# Altium project FR5969v1.0.PrjPcb
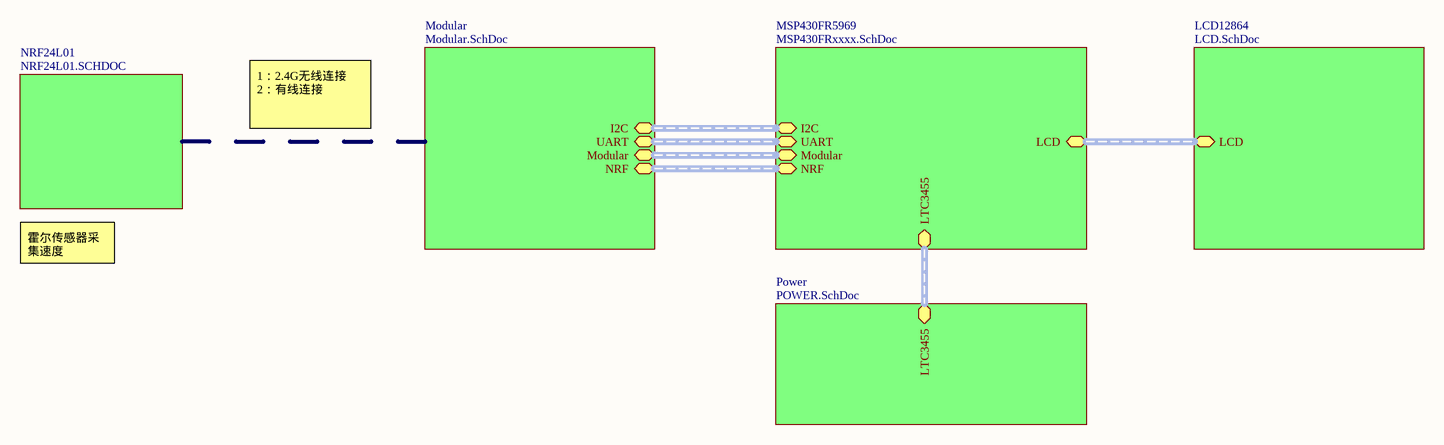
[diagram p0: FR5969v1.0.SchDoc]
5 sheets, 80 parts. Net scope: hierarchical (ports join the sheet entries above them; power ports are global).
Board file: FR5969v1.0.PcbDoc
Sheets:
  FR5969v1.0.SchDoc
    MSP430FR5969 = MSP430FRxxxx.SchDoc
    Modular = Modular.SchDoc
    LCD12864 = LCD.SchDoc
    Power = POWER.SchDoc

## Sheet FR5969v1.0.SchDoc
size A4

### Sub-sheets
LCD12864 = LCD.SchDoc: LCD (harness LCD)
Modular = Modular.SchDoc: I2C (harness IC2), UART (harness UART), Modular (harness Modular), NRF (harness NRF)
MSP430FR5969 = MSP430FRxxxx.SchDoc: LCD (harness LCD), LTC3455 (harness LTC3455), I2C (harness IC2), UART (harness UART), Modular (harness Modular), NRF (harness NRF)
NRF24L01 = NRF24L01.SCHDOC (file not in this document): no entries
Power = POWER.SchDoc: LTC3455 (harness LTC3455)

### Buses and harness runs
harness sheet LCD12864/LCD = sheet MSP430FR5969/LCD
harness sheet Modular/I2C = sheet MSP430FR5969/I2C
harness sheet Modular/Modular = sheet MSP430FR5969/Modular
harness sheet Modular/NRF = sheet MSP430FR5969/NRF
harness sheet Modular/UART = sheet MSP430FR5969/UART
harness sheet MSP430FR5969/LTC3455 = sheet Power/LTC3455

### Notes on the sheet
- 1：2.4G无线连接
  2：有线连接
- 霍尔传感器采集速度

## Sheet MSP430FRxxxx.SchDoc
size A4; Organization: Altium Limited; Address1: L3, 12a Rodborough Rd; Address2: Frenchs Forest; Address3: NSW; Address4: Australia 2086
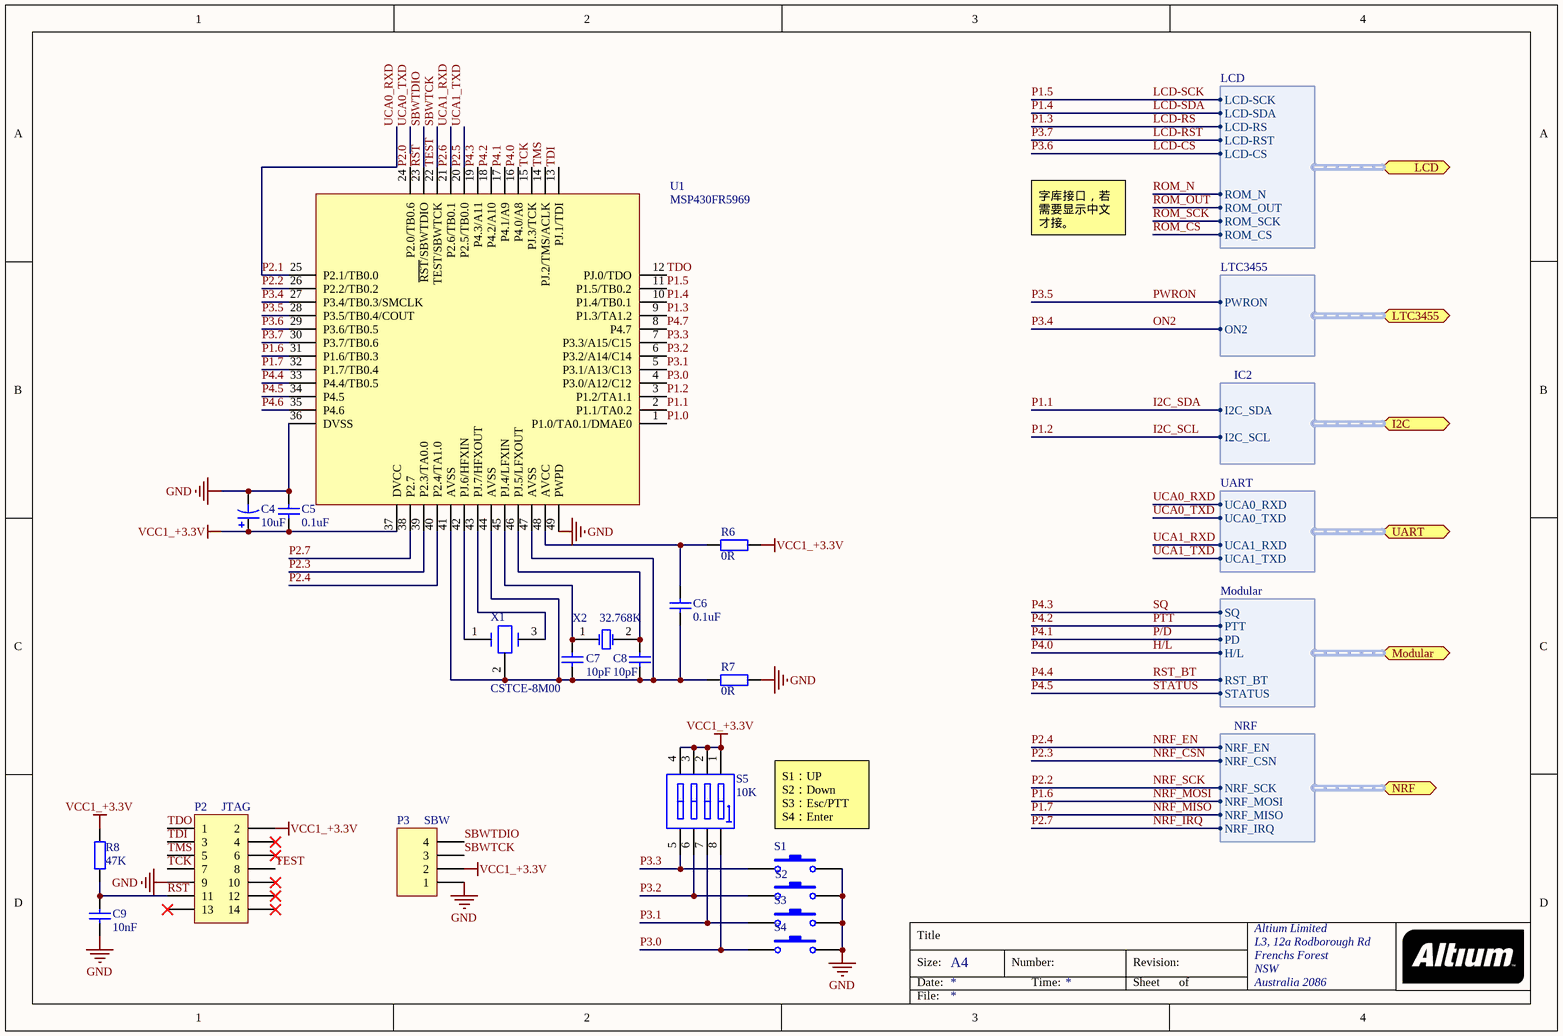
[diagram p1: MSP430FRxxxx.SchDoc]

### Parts
C4  value 10uF  [SMA-C]  (hidden comment: Cap Pol1)
C5  value 0.1uF  [C0805]  (hidden comment: Cap)
C6  value 0.1uF  [C0805]  (hidden comment: Cap)
C7  value 10pF  [C0805]  (hidden comment: Cap)
C8  value 10pF  [C0805]  (hidden comment: Cap)
C9  value 10nF  [C0805]  (hidden comment: Cap)
P2  JTAG  [JTAG]
P3  SBW  [HDR1X4]
R6  value 0R  [R0805]  (hidden comment: Res2)
R7  value 0R  [R0805]  (hidden comment: Res2)
R8  value 47K  [R0805]  (hidden comment: Res2)
S1  SW-PB  [SW-SMD1]  (value not drawn)
S2  SW-PB  [SW-SMD1]  (value not drawn)
S3  SW-PB  [SW-SMD1]  (value not drawn)
S4  SW-PB  [SW-SMD1]  (value not drawn)
S5  10K  [R0805-4P]
U1  MSP430FR5969  [QFN-48]
X1  CSTCE-8M00  [CSTCE-8M00]
X2  32.768K  [32768]

### Ports
I2C (harness IC2), LCD (harness LCD), LTC3455 (harness LTC3455), Modular (harness Modular), NRF (harness NRF), UART (harness UART)

### Harnesses
LTC3455: PWRON, ON2
IC2: I2C_SDA, I2C_SCL
UART: UCA0_RXD, UCA0_TXD, UCA1_RXD, UCA1_TXD
Modular: SQ, PTT, PD, H/L, RST_BT, STATUS
NRF: NRF_EN, NRF_CSN, NRF_SCK, NRF_MOSI, NRF_MISO, NRF_IRQ
LCD: LCD-SCK, LCD-SDA, LCD-RS, LCD-RST, LCD-CS, ROM_N, ROM_OUT, ROM_SCK, ROM_CS

### Nets
GND: C4.2 C5.1 C9.2 P2.9 P3.1 R7.2 S1.2 S2.2 S3.2 S4.2 U1.36(DVSS) U1.49(PWPD)
VCC1_+3.3V: C4.1 C5.2 P2.2 P3.2 R6.2 R8.2 S5.1(A1) S5.2(A2) S5.3(A3) S5.4(A4) U1.37(DVCC)
H/L: U1.16(P4.0/A8) ; port Modular.H/L  [also labelled P4.0]
I2C_SCL: U1.3(P1.2/TA1.1) ; port I2C.I2C_SCL  [also labelled P1.2]
I2C_SDA: U1.2(P1.1/TA0.2) ; port I2C.I2C_SDA  [also labelled P1.1]
LCD-CS: U1.29(P3.6/TB0.5) ; port LCD.LCD-CS  [also labelled P3.6]
LCD-RS: U1.9(P1.3/TA1.2) ; port LCD.LCD-RS  [also labelled P1.3]
LCD-RST: U1.30(P3.7/TB0.6) ; port LCD.LCD-RST  [also labelled P3.7]
LCD-SCK: U1.11(P1.5/TB0.2) ; port LCD.LCD-SCK  [also labelled P1.5]
LCD-SDA: U1.10(P1.4/TB0.1) ; port LCD.LCD-SDA  [also labelled P1.4]
NRF_CSN: U1.39(P2.3/TA0.0) ; port NRF.NRF_CSN  [also labelled P2.3]
NRF_EN: U1.40(P2.4/TA1.0) ; port NRF.NRF_EN  [also labelled P2.4]
NRF_IRQ: U1.38(P2.7) ; port NRF.NRF_IRQ  [also labelled P2.7]
NRF_MISO: U1.32(P1.7/TB0.4) ; port NRF.NRF_MISO  [also labelled P1.7]
NRF_MOSI: U1.31(P1.6/TB0.3) ; port NRF.NRF_MOSI  [also labelled P1.6]
NRF_SCK: U1.26(P2.2/TB0.2) ; port NRF.NRF_SCK  [also labelled P2.2]
ON2: U1.27(P3.4/TB0.3/SMCLK) ; port LTC3455.ON2  [also labelled P3.4]
P1.0: U1.1(P1.0/TA0.1/DMAE0)
P2.0: U1.24(P2.0/TB0.6)
P2.1: U1.25(P2.1/TB0.0) ; port UART.UCA0_RXD  [also labelled UCA0_RXD]
P2.5: U1.20(P2.5/TB0.0) ; port UART.UCA1_TXD  [also labelled UCA1_TXD]
P2.6: U1.21(P2.6/TB0.1) ; port UART.UCA1_RXD  [also labelled UCA1_RXD]
P3.0: S4.1 S5.8(B1) U1.4(P3.0/A12/C12)
P3.1: S3.1 S5.7(B2) U1.5(P3.1/A13/C13)
P3.2: S2.1 S5.6(B3) U1.6(P3.2/A14/C14)
P3.3: S1.1 S5.5(B4) U1.7(P3.3/A15/C15)
P3.5: U1.28(P3.5/TB0.4/COUT) ; port LTC3455.PWRON  [also labelled PWRON]
P4.2: U1.18(P4.2/A10) ; port Modular.PTT  [also labelled PTT]
P4.3: U1.19(P4.3/A11) ; port Modular.SQ  [also labelled SQ]
P4.4: U1.33(P4.4/TB0.5) ; port Modular.RST_BT  [also labelled RST_BT]
P4.5: U1.34(P4.5) ; port Modular.STATUS  [also labelled STATUS]
P4.6: U1.35(P4.6)
P4.7: U1.8(P4.7)
P/D: U1.17(P4.1/A9) ; port Modular.PD  [also labelled P4.1]
~{RST}: C9.1 P2.11 P3.4 R8.1 U1.23(~{RST}/SBWTDIO)  [also labelled SBWTDIO]
SBWTCK: P2.8 P3.3 U1.22(TEST/SBWTCK)  [also labelled TEST]
TCK: P2.7 U1.15(PJ.3/TCK)
TDI: P2.3 U1.13(PJ.1/TDI)
TDO: P2.1 U1.12(PJ.0/TDO)
TMS: P2.5 U1.14(PJ.2/TMS/ACLK)
NetC6_1: C6.1 R6.1 U1.48(AVCC)
NetC6_2: C6.2 C7.1 C8.1 R7.1 U1.41(AVSS) U1.44(AVSS) U1.47(AVSS) X1.2
NetC7_2: C7.2 U1.45(PJ.4/LFXIN) X2.1(OSC1)
NetC8_2: C8.2 U1.46(PJ.5/LFXOUT) X2.2(OSC2)
NetU1_42: U1.42(PJ.6/HFXIN) X1.1
NetU1_43: U1.43(PJ.7/HFXOUT) X1.3

Not connected (* = marked no-connect by the designer): P2 4* 6* 10* 12* 13* 14*

### Notes on the sheet
- 字库接口，若需要显示中文才接。
- S1：UP
  S2：Down
  S3：Esc/PTT
  S4：Enter
- Title
- Size:
- Date:
- A4
- Number:
- Time:
- Revision:
- Sheet
- of
- File:

### Library data of the parts
C4 = Cap Pol1: Polarized Capacitor (Radial); Published: 8-Jun-2000; LatestRevisionDate: 17-Jul-2002; LatestRevisionNote: Re-released for DXP Platform.; PackageReference: RB7.6-15; Publisher: Altium Limited; PackageDescription: Polarized Capacitor (Radial); 2 Leads
C5-C9 = Cap: Capacitor; Published: 8-Jun-2000; LatestRevisionDate: 17-Jul-2002; LatestRevisionNote: Re-released for DXP Platform.; PackageReference: RAD-0.3; Publisher: Altium Limited; PackageDescription: Radial Cap, Thru-Hole; 2 Leads; 0.3 in Pin Spacing
P2 = Header 7X2: Header, 7-Pin, Dual row; LatestRevisionDate: 17-Jul-2002; LatestRevisionNote: Re-released for DXP Platform.; Publisher: Altium Limited
P3 = Header 4: Header, 4-Pin; LatestRevisionDate: 17-Jul-2002; LatestRevisionNote: Re-released for DXP Platform.; Publisher: Altium Limited
R6-R8 = Res2: Resistor; Published: 8-Jun-2000; LatestRevisionDate: 17-Jul-2002; LatestRevisionNote: Re-released for DXP Platform.; PackageReference: AXIAL-0.4; Publisher: Altium Limited; PackageDescription: Axial Device, Thru-Hole; 2 Leads; 0.4 in Pin Spacing
S1-S4 = SW-PB: Switch; Published: 24-Mar-1999; LatestRevisionDate: 17-Jul-2002; LatestRevisionNote: Re-released for DXP Platform.; PackageReference: SPST-2; Publisher: Altium Limited; PackageDescription: Switch; 2 Leads
S5 = SW DIP-4: DIP Switch, 4 Position, SPST; Published: 24-Mar-1999; LatestRevisionDate: 29-May-2009; LatestRevisionNote: IPC-7351 Footprint Added.; PackageVersion: Dec-2002; PackageReference: SO8; Publisher: Altium Limited; PackageDescription: 8-Pin Small Outline Integrated Circuit 1.27 mm Pitch; Code_JEDEC: MS-012-AA; Code_IPC: SOIC127P600-8
U1 = MSP430FR5969: MSP420FRxxxx
X2 = XTAL: Crystal Oscillator; Published: 8-Jun-2000; LatestRevisionDate: 17-Jul-2002; LatestRevisionNote: Re-released for DXP Platform.; PackageReference: R38; Publisher: Altium Limited; PackageDescription: Crystal, Thru-Hole; 2 Leads; Body 3.1 x 8.2 mm (Dia.xH)

## Sheet Modular.SchDoc
size A4; Organization: Altium Limited; Address1: L3, 12a Rodborough Rd; Address2: Frenchs Forest; Address3: NSW; Address4: Australia 2086
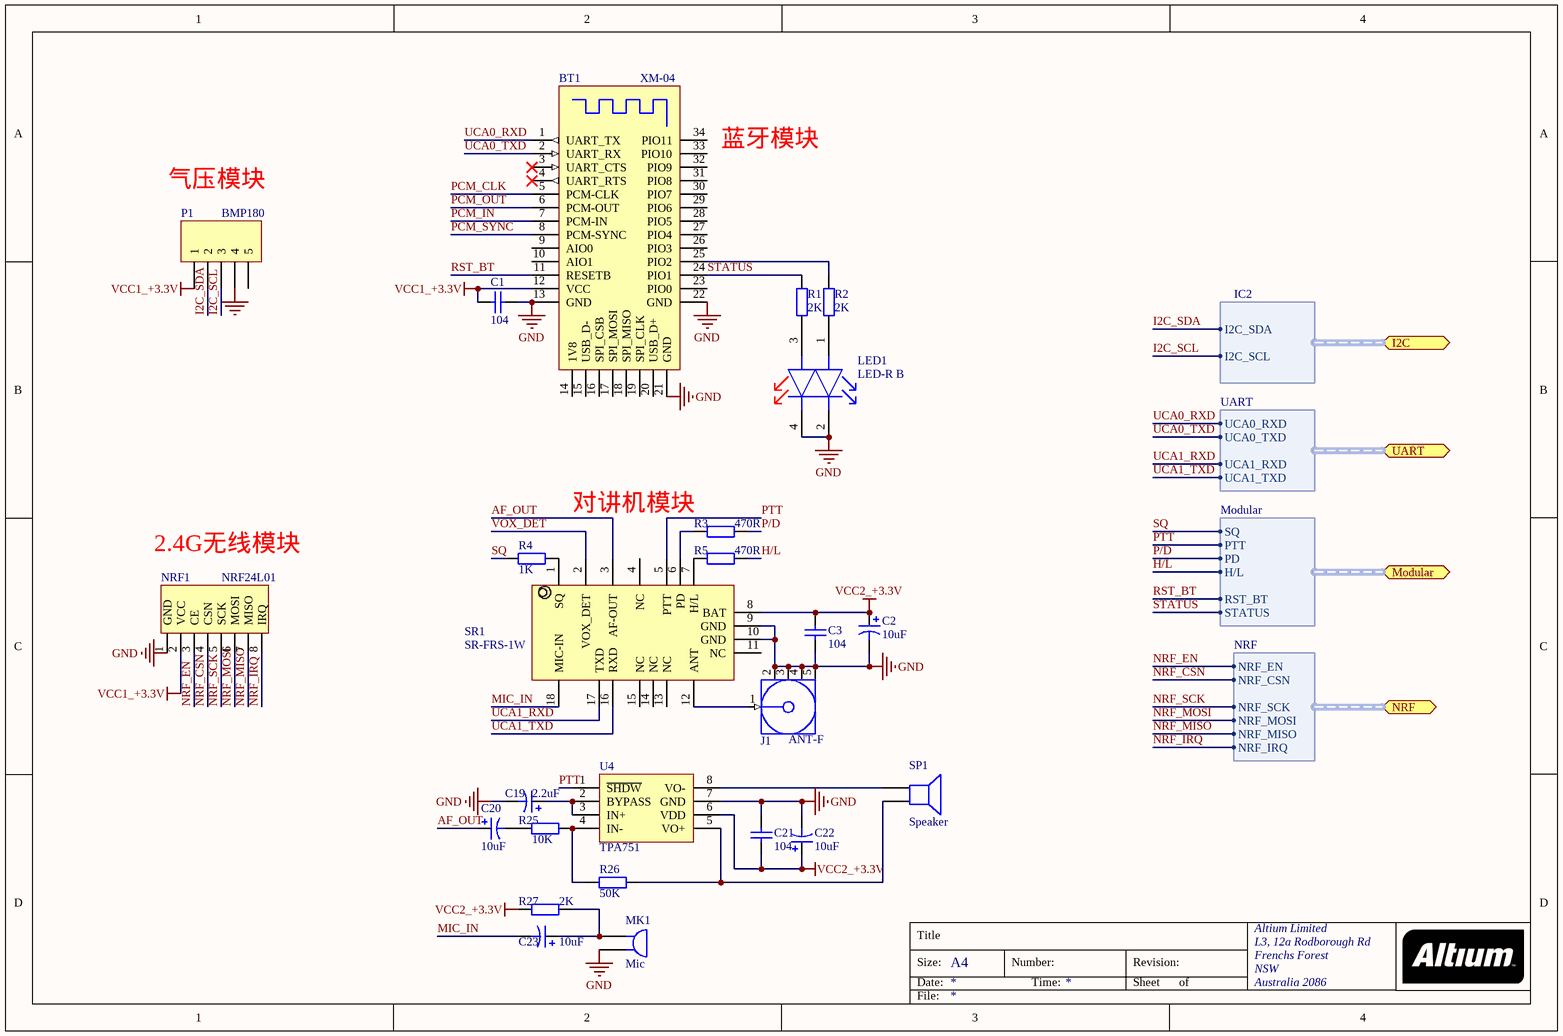
[diagram p2: Modular.SchDoc]

### Parts
BT1  XM-04  [XM-04]
C1  value 104  [C0805]  (hidden comment: Cap)
C2  value 10uF  [SMA-C]  (hidden comment: Cap Pol1)
C3  value 104  [C0805]  (hidden comment: Cap)
C19  value 2.2uF  [C3216A]  (hidden comment: Cap Pol1)
C20  value 10uF  [SMA-C]  (hidden comment: Cap Pol1)
C21  value 104  [C0805]  (hidden comment: Cap)
C22  value 10uF  [SMA-C]  (hidden comment: Cap Pol1)
C23  value 10uF  [SMA-C]  (hidden comment: Cap Pol1)
J1  ANT-F  [MCX5.08-H5]
LED1  LED-R B  [0805LED - r b]
MK1  Mic  [PIN2]
NRF1  NRF24L01  [NRF24L01]
P1  BMP180  [BMP-180]
R1  value 2K  [R0805]  (hidden comment: Res2)
R2  value 2K  [R0805]  (hidden comment: Res2)
R3  value 470R  [R0805]  (hidden comment: Res2)
R4  value 1K  [R0805]  (hidden comment: Res2)
R5  value 470R  [R0805]  (hidden comment: Res2)
R25  value 10K  [R0805]  (hidden comment: Res2)
R26  value 50K  [R0805]  (hidden comment: Res2)
R27  value 2K  [R0805]  (hidden comment: Res2)
SP1  Speaker  [PIN2]
SR1  SR-FRS-1W  [SR-FRS-1W]
U4  TPA751  [SO-8]

### Ports
I2C (harness IC2), Modular (harness Modular), NRF (harness NRF), UART (harness UART)

### Harnesses
IC2: I2C_SDA, I2C_SCL
UART: UCA0_RXD, UCA0_TXD, UCA1_RXD, UCA1_TXD
Modular: SQ, PTT, PD, H/L, RST_BT, STATUS
NRF: NRF_EN, NRF_CSN, NRF_SCK, NRF_MOSI, NRF_MISO, NRF_IRQ

### Nets
GND: BT1.13(GND) BT1.21(GND) BT1.22(GND) C1.1 C2.2 C3.2 C19.2 C21.2 C22.2 J1.2(GND) J1.3(GND) J1.4(GND) J1.5(GND) LED1.2 LED1.4 MK1.2 NRF1.1(GND) P1.4 SR1.9(GND) SR1.10(GND) U4.7(GND)
VCC1_+3.3V: BT1.12(VCC) C1.2 NRF1.2(VCC) P1.1
VCC2_+3.3V: C2.1 C3.1 C21.1 C22.1 R27.2 SR1.8(BAT) U4.6(VDD)
AF_OUT: C20.1 SR1.3(AF-OUT)
H/L: R5.2 ; port Modular.H/L
I2C_SCL: P1.3 ; port I2C.I2C_SCL
I2C_SDA: P1.2 ; port I2C.I2C_SDA
MIC_IN: C23.2 SR1.18(MIC-IN)
NRF_CSN: NRF1.4(CSN) ; port NRF.NRF_CSN
NRF_EN: NRF1.3(CE) ; port NRF.NRF_EN
NRF_IRQ: NRF1.8(IRQ) ; port NRF.NRF_IRQ
NRF_MISO: NRF1.7(MISO) ; port NRF.NRF_MISO
NRF_MOSI: NRF1.6(MOSI) ; port NRF.NRF_MOSI
NRF_SCK: NRF1.5(SCK) ; port NRF.NRF_SCK
P/D: R3.1 ; port Modular.PD
PCM_CLK: BT1.5(PCM-CLK)
PCM_IN: BT1.7(PCM-IN)
PCM_OUT: BT1.6(PCM-OUT)
PCM_SYNC: BT1.8(PCM-SYNC)
PTT: SR1.5(PTT) U4.1(~{SHDW}) ; port Modular.PTT  [project net P4.2]
RST_BT: BT1.11(RESETB) ; port Modular.RST_BT  [project net P4.4]
SQ: R4.2 ; port Modular.SQ  [project net P4.3]
STATUS: BT1.24(PIO1) R1.1 ; port Modular.STATUS  [project net P4.5]
UCA0_RXD: BT1.1(UART_TX) ; port UART.UCA0_RXD  [project net P2.1]
UCA0_TXD: BT1.2(UART_RX) ; port UART.UCA0_TXD
UCA1_RXD: SR1.17(TXD) ; port UART.UCA1_RXD  [project net P2.6]
UCA1_TXD: SR1.16(RXD) ; port UART.UCA1_TXD  [project net P2.5]
VOX_DET: SR1.2(VOX_DET)
NetBT1_25: BT1.25(PIO2) R2.1
NetC19_1: C19.1 U4.2(BYPASS) U4.3(IN+)
NetC20_2: C20.2 R25.2
NetC23_1: C23.1 MK1.1 R27.1
NetJ1_1: J1.1(Signal) SR1.12(ANT)
NetLED1_1: LED1.1 R2.2
NetLED1_3: LED1.3 R1.2
NetR3_2: R3.2 SR1.6(PD)
NetR4_1: R4.1 SR1.1(SQ)
NetR5_1: R5.1 SR1.7(H/L)
NetR25_1: R25.1 R26.2 U4.4(IN-)
NetR26_1: R26.1 SP1.2 U4.5(VO+)
NetSP1_1: SP1.1 U4.8(VO-)

Not connected (* = marked no-connect by the designer): BT1 3(UART_CTS)* 4(UART_RTS)* 9(AIO0) 10(AIO1) 14(1V8) 15(USB_D-) 16(SPI_CSB) 17(SPI_MOSI) 18(SPI_MISO) 19(SPI_CLK) 20(USB_D+) 23(PIO0) 26(PIO3) 27(PIO4) 28(PIO5) 29(PIO6) 30(PIO7) 31(PIO8) 32(PIO9) 33(PIO10) 34(PIO11); P1 5; SR1 4(NC) 11(NC) 13(NC) 14(NC) 15(NC)

### Notes on the sheet
- (near BT1) 蓝牙模块
- 气压模块
- 对讲机模块
- 2.4G无线模块
- Title
- Size:
- Date:
- A4
- Number:
- Time:
- Revision:
- Sheet
- of
- File:

### Library data of the parts
C1 C3 C21 = Cap: Capacitor; Published: 8-Jun-2000; LatestRevisionDate: 17-Jul-2002; LatestRevisionNote: Re-released for DXP Platform.; PackageReference: RAD-0.3; Publisher: Altium Limited; PackageDescription: Radial Cap, Thru-Hole; 2 Leads; 0.3 in Pin Spacing
C2 C19 C20 C22 C23 = Cap Pol1: Polarized Capacitor (Radial); Published: 8-Jun-2000; LatestRevisionDate: 17-Jul-2002; LatestRevisionNote: Re-released for DXP Platform.; PackageReference: RB7.6-15; Publisher: Altium Limited; PackageDescription: Polarized Capacitor (Radial); 2 Leads
J1 = COAX-F: RF Coaxial PCB Connector, MCX; Thru-Hole, Right-Angle Mount Socket, Blunt Post Terminal, 50 Ohm Impedance; PCB_Layout: Complies with manufacturer's recommendation.; DrillSize: Corresponds to nominal value.; Published: 15-Jul-2004; LatestRevisionDate: 15-Jul-2004; LatestRevisionNote: Component Replaced.; DatasheetDocument: 30-May-2003; PackageDocument: 04-Jul-1999; PackageReference: 919-119J-51AX; Publisher: Altium Limited; ComponentLink1Description: Manufacturer Link; ComponentLink1URL: http://www.amphenolrf.com/
MK1 = Mic1: Microphone; Published: 24-Mar-1999; LatestRevisionDate: 17-Jul-2002; LatestRevisionNote: Re-released for DXP Platform.; PackageReference: PIN2; Publisher: Altium Limited
P1 = Header 5: Header, 5-Pin; LatestRevisionDate: 17-Jul-2002; LatestRevisionNote: Re-released for DXP Platform.; Publisher: Altium Limited
R1-R5 R25-R27 = Res2: Resistor; Published: 8-Jun-2000; LatestRevisionDate: 17-Jul-2002; LatestRevisionNote: Re-released for DXP Platform.; PackageReference: AXIAL-0.4; Publisher: Altium Limited; PackageDescription: Axial Device, Thru-Hole; 2 Leads; 0.4 in Pin Spacing
SP1 = Speaker: Loudspeaker; Published: 24-Mar-1999; LatestRevisionDate: 17-Jul-2002; LatestRevisionNote: Re-released for DXP Platform.; PackageReference: PIN2; Publisher: Altium Limited
U4 = TPA751: 700mW AB类OP

## Sheet LCD.SchDoc
size A4; Organization: Altium Limited; Address1: L3, 12a Rodborough Rd; Address2: Frenchs Forest; Address3: NSW; Address4: Australia 2086
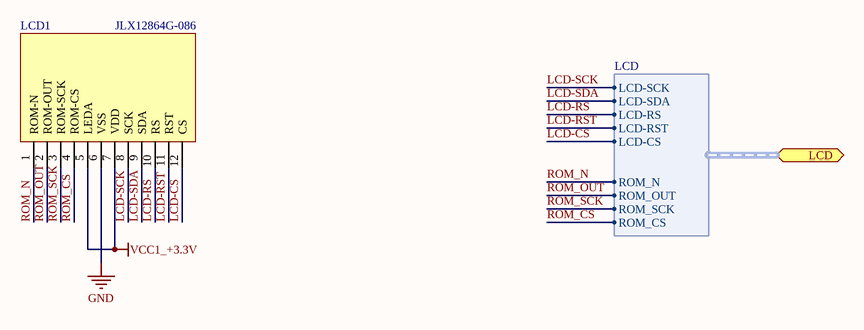
[diagram p3: LCD.SchDoc]

### Parts
LCD1  JLX12864G-086  [12864-IIC]

### Ports
LCD (harness LCD)

### Harnesses
LCD: LCD-SCK, LCD-SDA, LCD-RS, LCD-RST, LCD-CS, ROM_N, ROM_OUT, ROM_SCK, ROM_CS

### Nets
GND: LCD1.6(VSS)
VCC1_+3.3V: LCD1.5(LEDA) LCD1.7(VDD)
LCD-CS: LCD1.12(CS) ; port LCD.LCD-CS
LCD-RS: LCD1.10(RS) ; port LCD.LCD-RS
LCD-RST: LCD1.11(RST) ; port LCD.LCD-RST
LCD-SCK: LCD1.8(SCK) ; port LCD.LCD-SCK
LCD-SDA: LCD1.9(SDA) ; port LCD.LCD-SDA
ROM_CS: LCD1.4(ROM-CS) ; port LCD.ROM_CS
ROM_N: LCD1.1(ROM-N) ; port LCD.ROM_N
ROM_OUT: LCD1.2(ROM-OUT) ; port LCD.ROM_OUT
ROM_SCK: LCD1.3(ROM-SCK) ; port LCD.ROM_SCK

### Notes on the sheet
- Title
- Size:
- Date:
- A4
- Number:
- Time:
- Revision:
- Sheet
- of
- File:

### Library data of the parts
LCD1 = JLX12864G-086: LCD

## Sheet POWER.SchDoc
size A4; Organization: Altium Limited; Address1: L3, 12a Rodborough Rd; Address2: Frenchs Forest; Address3: NSW; Address4: Australia 2086
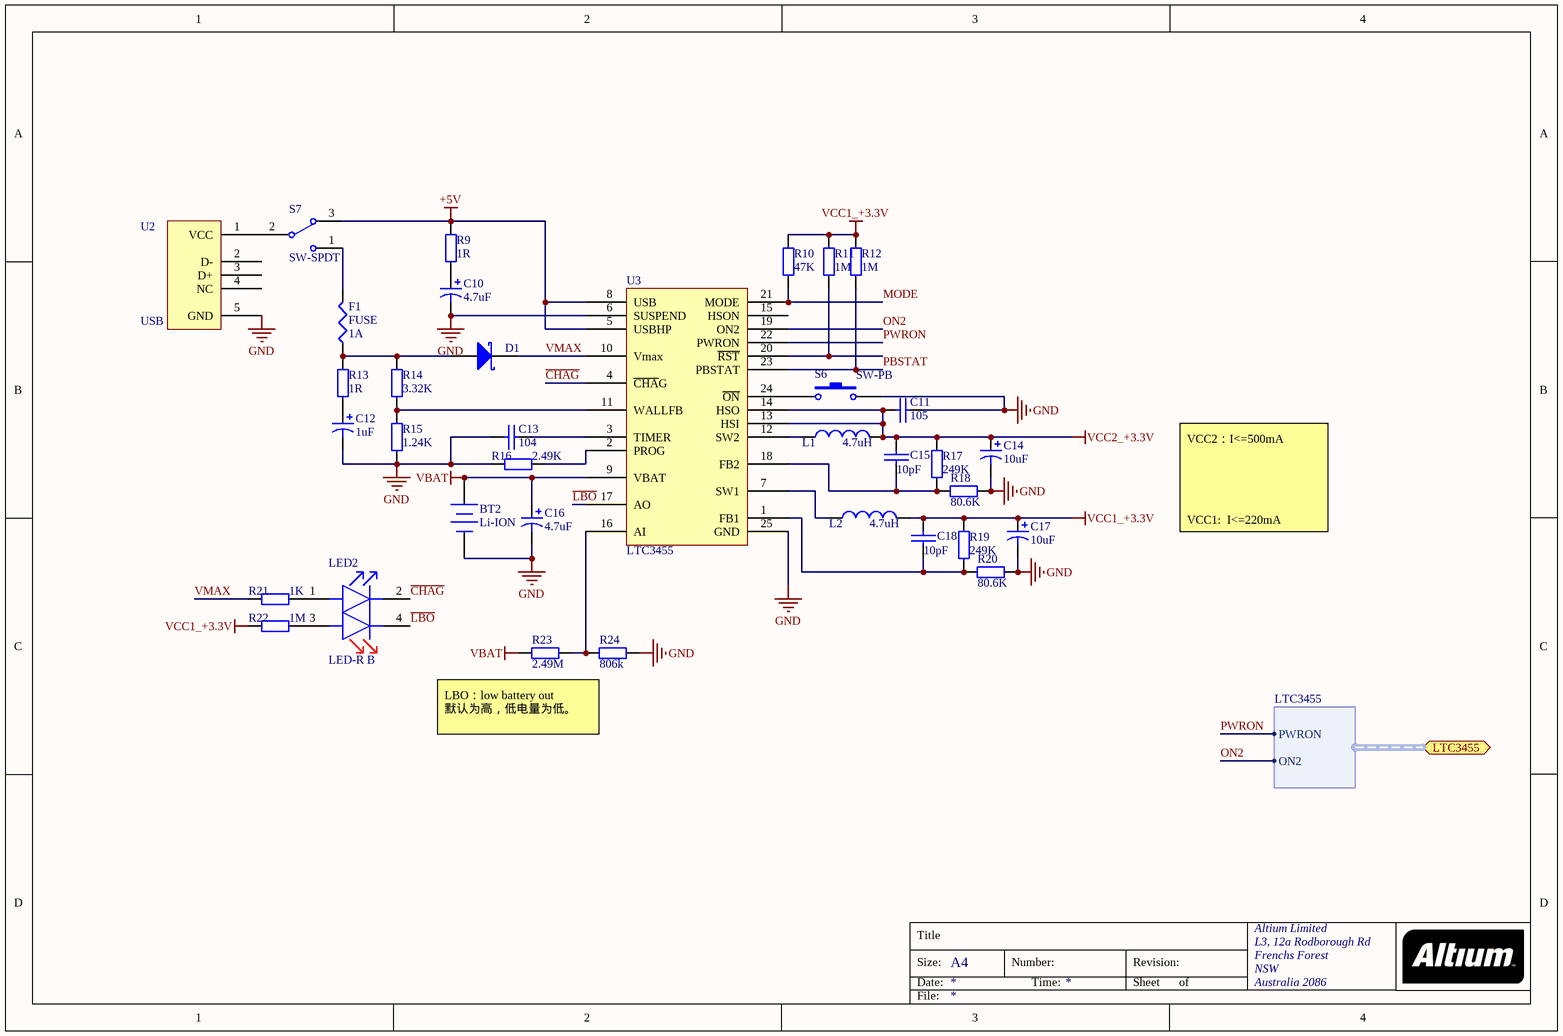
[diagram p4: POWER.SchDoc]

### Parts
BT2  Li-ION  [BAT-2]
C10  value 4.7uF  [SMA-C]  (hidden comment: Cap Pol1)
C11  105  [C0805]
C12  value 1uF  [C0805]  (hidden comment: Cap Pol1)
C13  104  [C0805]
C14  value 10uF  [SMA-C]  (hidden comment: Cap Pol1)
C15  10pF  [C0805]
C16  value 4.7uF  [SMA-C]  (hidden comment: Cap Pol1)
C17  value 10uF  [SMA-C]  (hidden comment: Cap Pol1)
C18  10pF  [C0805]
D1  MBR120  [DO-214AB]  (value not drawn)
F1  FUSE  value 1A  [R1812]
L1  value 4.7uH  [L-5X4mm-S]  (hidden comment: Inductor)
L2  value 4.7uH  [L-5X4mm-S]  (hidden comment: Inductor)
LED2  LED-R B  [0805LED - r b]
R9  value 1R  [R0805]  (hidden comment: Res2)
R10  value 47K  [R0805]  (hidden comment: Res2)
R11  value 1M  [R0805]  (hidden comment: Res2)
R12  value 1M  [R0805]  (hidden comment: Res2)
R13  value 1R  [R0805]  (hidden comment: Res2)
R14  value 3.32K  [R0805]  (hidden comment: Res2)
R15  value 1.24K  [R0805]  (hidden comment: Res2)
R16  value 2.49K  [R0805]  (hidden comment: Res2)
R17  value 249K  [R0805]  (hidden comment: Res2)
R18  value 80.6K  [R0805]  (hidden comment: Res2)
R19  value 249K  [R0805]  (hidden comment: Res2)
R20  value 80.6K  [R0805]  (hidden comment: Res2)
R21  value 1K  [R0805]  (hidden comment: Res2)
R22  value 1M  [R0805]  (hidden comment: Res2)
R23  value 2.49M  [R0805]  (hidden comment: Res2)
R24  value 806k  [R0805]  (hidden comment: Res2)
S6  SW-PB  [SW-SMD1]
S7  SW-SPDT  [HDR1X3]
U2  USB  [USB-mini]
U3  LTC3455  [QFN-24]

### Ports
LTC3455 (harness LTC3455)

### Harnesses
LTC3455: PWRON, ON2

### Nets
+5V: R9.2 S7.3 U3.5(USBHP) U3.8(USB)
GND: BT2.2(-) C10.2 C11.1 C12.2 C13.2 C14.2 C16.2 C17.2 R15.2 R16.1 R18.1 R20.1 R24.1 S6.2 U2.5(GND) U3.6(SUSPEND) U3.25(GND)
VBAT: BT2.1(+) C16.1 R23.2 U3.9(VBAT)
VCC1_+3.3V: C17.1 C18.1 L2.2 R10.2 R11.2 R12.2 R19.2 R22.1
VCC2_+3.3V: C11.2 C14.1 C15.1 L1.2 R17.2 U3.13(HSI) U3.14(HSO)
~{CHAG}: LED2.2 U3.4(~{CHA}G)
~{LBO}: LED2.4 U3.17(AO)
MODE: R10.1 U3.21(MODE)
ON2: U3.19(ON2) ; port LTC3455.ON2
PBSTAT: R12.1 U3.23(PBSTAT)
PWRON: U3.22(PWRON) ; port LTC3455.PWRON  [project net P3.5]
VMAX: D1.2(K) R21.2 U3.10(Vmax)
NetC10_1: C10.1 R9.1
NetC12_1: C12.1 R13.1
NetC13_1: C13.1 U3.3(TIMER)
NetC15_2: C15.2 R17.1 R18.2 U3.18(FB2)
NetC18_2: C18.2 R19.1 R20.2 U3.1(FB1)
NetD1_1: D1.1(A) F1.1 R13.2 R14.2
NetF1_2: F1.2 S7.1
NetL1_1: L1.1 U3.12(SW2)
NetL2_1: L2.1 U3.7(SW1)
NetLED2_1: LED2.1 R21.1
NetLED2_3: LED2.3 R22.2
NetR11_1: R11.1 U3.20(~{RST})
NetR14_1: R14.1 R15.1 U3.11(WALLFB)
NetR16_2: R16.2 U3.2(PROG)
NetR23_1: R23.1 R24.2 U3.16(AI)
NetS6_1: S6.1 U3.24(~{ON})
NetS7_2: S7.2 U2.1(VCC)

Not connected (* = marked no-connect by the designer): U2 2(D-) 3(D+) 4(NC); U3 15(HSON)

### Notes on the sheet
- VCC2：I<=500mA
  VCC1:  I<=220mA
- LBO：low battery out
  默认为高，低电量为低。
- Title
- Size:
- Date:
- A4
- Number:
- Time:
- Revision:
- Sheet
- of
- File:

### Library data of the parts
BT2 = Battery: Multicell Battery; Published: 24-Mar-1999; LatestRevisionDate: 17-Jul-2002; LatestRevisionNote: Re-released for DXP Platform.; PackageReference: BAT-2; Publisher: Altium Limited; PackageDescription: Battery; 2 Leads
C10 C12 C14 C16 C17 = Cap Pol1: Polarized Capacitor (Radial); Published: 8-Jun-2000; LatestRevisionDate: 17-Jul-2002; LatestRevisionNote: Re-released for DXP Platform.; PackageReference: RB7.6-15; Publisher: Altium Limited; PackageDescription: Polarized Capacitor (Radial); 2 Leads
C11 C13 C15 C18 = CAP: Capacitor
D1 = D Schottky: Schottky Diode; Published: 8-Jun-2000; LatestRevisionDate: 17-Jul-2002; LatestRevisionNote: Re-released for DXP Platform.; PackageReference: SMB; Publisher: Altium Limited; PackageDescription: DO-214-AA/SMB; 2 C-Bend Leads; Body 5.3 x 3.6 mm, inc. leads (LxW); Code_JEDEC: DO-214-AA
F1 = Res3: Resistor; Published: 8-Jun-2000; LatestRevisionDate: 29-May-2009; LatestRevisionNote: IPC-7351 Footprint Added.; PackageReference: J1-0603; Publisher: Altium Limited; PackageDescription: Chip Resistor
L1 L2 = Inductor: Code_IEC: 1005; Published: 8-Jun-2000; LatestRevisionDate: 29-May-2009; LatestRevisionNote: IPC-7351 Footprint Added.; PackageReference: 0402-A; Publisher: Altium Limited; PackageDescription: Chip Inductor; Code_JEITA: 0402
R9-R24 = Res2: Resistor; Published: 8-Jun-2000; LatestRevisionDate: 17-Jul-2002; LatestRevisionNote: Re-released for DXP Platform.; PackageReference: AXIAL-0.4; Publisher: Altium Limited; PackageDescription: Axial Device, Thru-Hole; 2 Leads; 0.4 in Pin Spacing
S6 = SW-PB: Switch; Published: 24-Mar-1999; LatestRevisionDate: 17-Jul-2002; LatestRevisionNote: Re-released for DXP Platform.; PackageReference: SPST-2; Publisher: Altium Limited; PackageDescription: Switch; 2 Leads
S7 = SW-SPDT: SPDT Subminiature Toggle Switch, Right Angle Mounting, Vertical Actuation; Published: 24-Mar-1999; LatestRevisionDate: 17-Dec-2003; LatestRevisionNote: Schematic revised, PCB Footprint replaced.; DatasheetVersion: 05-Dec-2000; PackageReference: TL36WW15050; Publisher: Altium Limited; PackageDescription: Switch; 4 Leads; ComponentLink1Description: Manufacturer Link; ComponentLink1URL: http://www.apem.com
U3 = LTC3455: LI-CELL charger

## Nets that join several sheets
GND: MSP430FRxxxx (12 pins), Modular (21 pins), LCD (LCD1.6), POWER (17 pins)
VCC1_+3.3V: MSP430FRxxxx (11 pins), Modular (BT1.12 C1.2 NRF1.2 P1.1), LCD (LCD1.5 LCD1.7), POWER (8 pins)
VCC2_+3.3V: Modular (7 pins), POWER (7 pins)
H/L: MSP430FRxxxx (U1.16), Modular (R5.2)
I2C_SCL: MSP430FRxxxx (U1.3), Modular (P1.3)
I2C_SDA: MSP430FRxxxx (U1.2), Modular (P1.2)
LCD-CS: MSP430FRxxxx (U1.29), LCD (LCD1.12)
LCD-RS: MSP430FRxxxx (U1.9), LCD (LCD1.10)
LCD-RST: MSP430FRxxxx (U1.30), LCD (LCD1.11)
LCD-SCK: MSP430FRxxxx (U1.11), LCD (LCD1.8)
LCD-SDA: MSP430FRxxxx (U1.10), LCD (LCD1.9)
NRF_CSN: MSP430FRxxxx (U1.39), Modular (NRF1.4)
NRF_EN: MSP430FRxxxx (U1.40), Modular (NRF1.3)
NRF_IRQ: MSP430FRxxxx (U1.38), Modular (NRF1.8)
NRF_MISO: MSP430FRxxxx (U1.32), Modular (NRF1.7)
NRF_MOSI: MSP430FRxxxx (U1.31), Modular (NRF1.6)
NRF_SCK: MSP430FRxxxx (U1.26), Modular (NRF1.5)
ON2: MSP430FRxxxx (U1.27), POWER (U3.19)
P2.1: MSP430FRxxxx (U1.25), Modular (BT1.1)
P2.5: MSP430FRxxxx (U1.20), Modular (SR1.16)
P2.6: MSP430FRxxxx (U1.21), Modular (SR1.17)
P3.5: MSP430FRxxxx (U1.28), POWER (U3.22)
P4.2: MSP430FRxxxx (U1.18), Modular (SR1.5 U4.1)
P4.3: MSP430FRxxxx (U1.19), Modular (R4.2)
P4.4: MSP430FRxxxx (U1.33), Modular (BT1.11)
P4.5: MSP430FRxxxx (U1.34), Modular (BT1.24 R1.1)
P/D: MSP430FRxxxx (U1.17), Modular (R3.1)